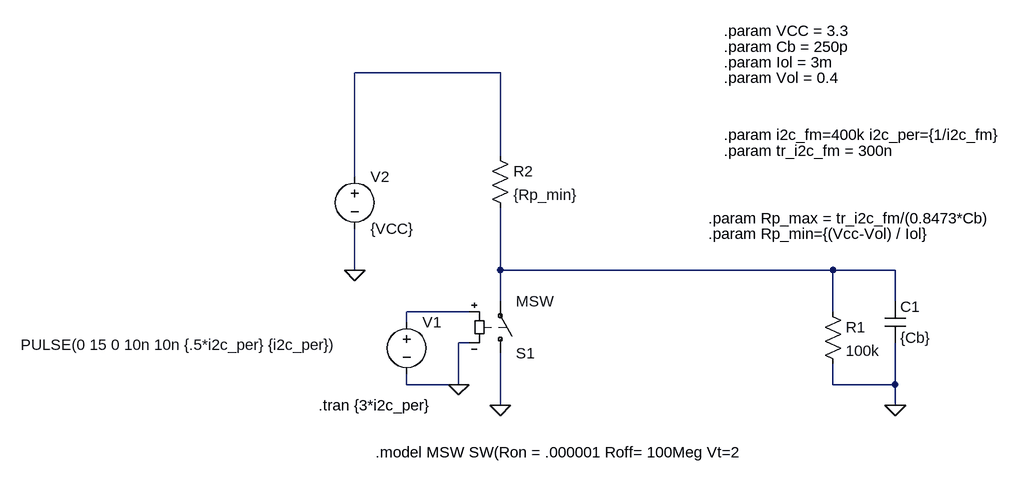
[diagram p0: schematic i2c.asc]
i2c.asc, the LTspice schematic file:
Version 4.1
SHEET 1 1016 680
WIRE 176 -592 -48 -592
WIRE 176 -464 176 -592
WIRE -48 -432 -48 -592
WIRE -48 -288 -48 -352
WIRE 176 -288 176 -384
WIRE 688 -288 176 -288
WIRE 784 -288 688 -288
WIRE 176 -240 176 -288
WIRE 784 -240 784 -288
WIRE 128 -224 32 -224
WIRE 688 -224 688 -288
WIRE 32 -208 32 -224
WIRE 128 -176 112 -176
WIRE 32 -112 32 -128
WIRE 112 -112 112 -176
WIRE 112 -112 32 -112
WIRE 688 -112 688 -144
WIRE 784 -112 784 -176
WIRE 784 -112 688 -112
WIRE 176 -80 176 -160
WIRE 784 -80 784 -112
FLAG 176 -80 0
FLAG 784 -80 0
FLAG -48 -288 0
FLAG 112 -112 0
SYMBOL voltage 32 -224 R0
WINDOW 3 -594 51 Left 2
WINDOW 123 0 0 Left 0
WINDOW 39 0 0 Left 0
SYMATTR Value PULSE(0 15 0 10n 10n {.5*i2c_per} {i2c_per})
SYMATTR InstName V1
SYMBOL cap 768 -240 R0
SYMATTR InstName C1
SYMATTR Value {Cb}
SYMBOL voltage -48 -448 R0
WINDOW 123 0 0 Left 0
WINDOW 39 0 0 Left 0
SYMATTR InstName V2
SYMATTR Value {VCC}
SYMBOL res 160 -480 R0
SYMATTR InstName R2
SYMATTR Value {Rp_min}
SYMBOL res 672 -240 R0
SYMATTR InstName R1
SYMATTR Value 100k
SYMBOL sw 176 -144 M180
SYMATTR InstName S1
SYMATTR Value MSW
TEXT 520 -496 Left 2 !.param i2c_fm=400k i2c_per={1/i2c_fm}
TEXT -104 -80 Left 2 !.tran {3*i2c_per}
TEXT -16 -8 Left 2 !.model MSW SW(Ron = .000001 Roff= 100Meg Vt=2
TEXT 520 -472 Left 2 !.param tr_i2c_fm = 300n
TEXT 496 -368 Left 2 !.param Rp_max = tr_i2c_fm/(0.8473*Cb)
TEXT 520 -632 Left 2 !.param Cb = 250p
TEXT 496 -344 Left 2 !.param Rp_min={(Vcc-Vol) / Iol}
TEXT 520 -656 Left 2 !.param VCC = 3.3
TEXT 520 -608 Left 2 !.param Iol = 3m
TEXT 520 -584 Left 2 !.param Vol = 0.4

The netlist it stands for:
* i2c.asc
V1 N003 0 PULSE(0 15 0 10n 10n {.5*i2c_per} {i2c_per})
C1 N002 0 {Cb}
V2 N001 0 {VCC}
R2 N001 N002 {Rp_min}
R1 N002 0 100k
S1 0 N002 N003 0 MSW
.param i2c_fm=400k i2c_per={1/i2c_fm}
.tran {3*i2c_per}
.model MSW SW(Ron = .000001 Roff= 100Meg Vt=2
.param tr_i2c_fm = 300n
.param Rp_max = tr_i2c_fm/(0.8473*Cb)
.param Cb = 250p
.param Rp_min={(Vcc-Vol) / Iol}
.param VCC = 3.3
.param Iol = 3m
.param Vol = 0.4
.backanno
.end